# EAGLE design RGBdriverModuleAutoCurrentSingle (EAGLE 5.07)
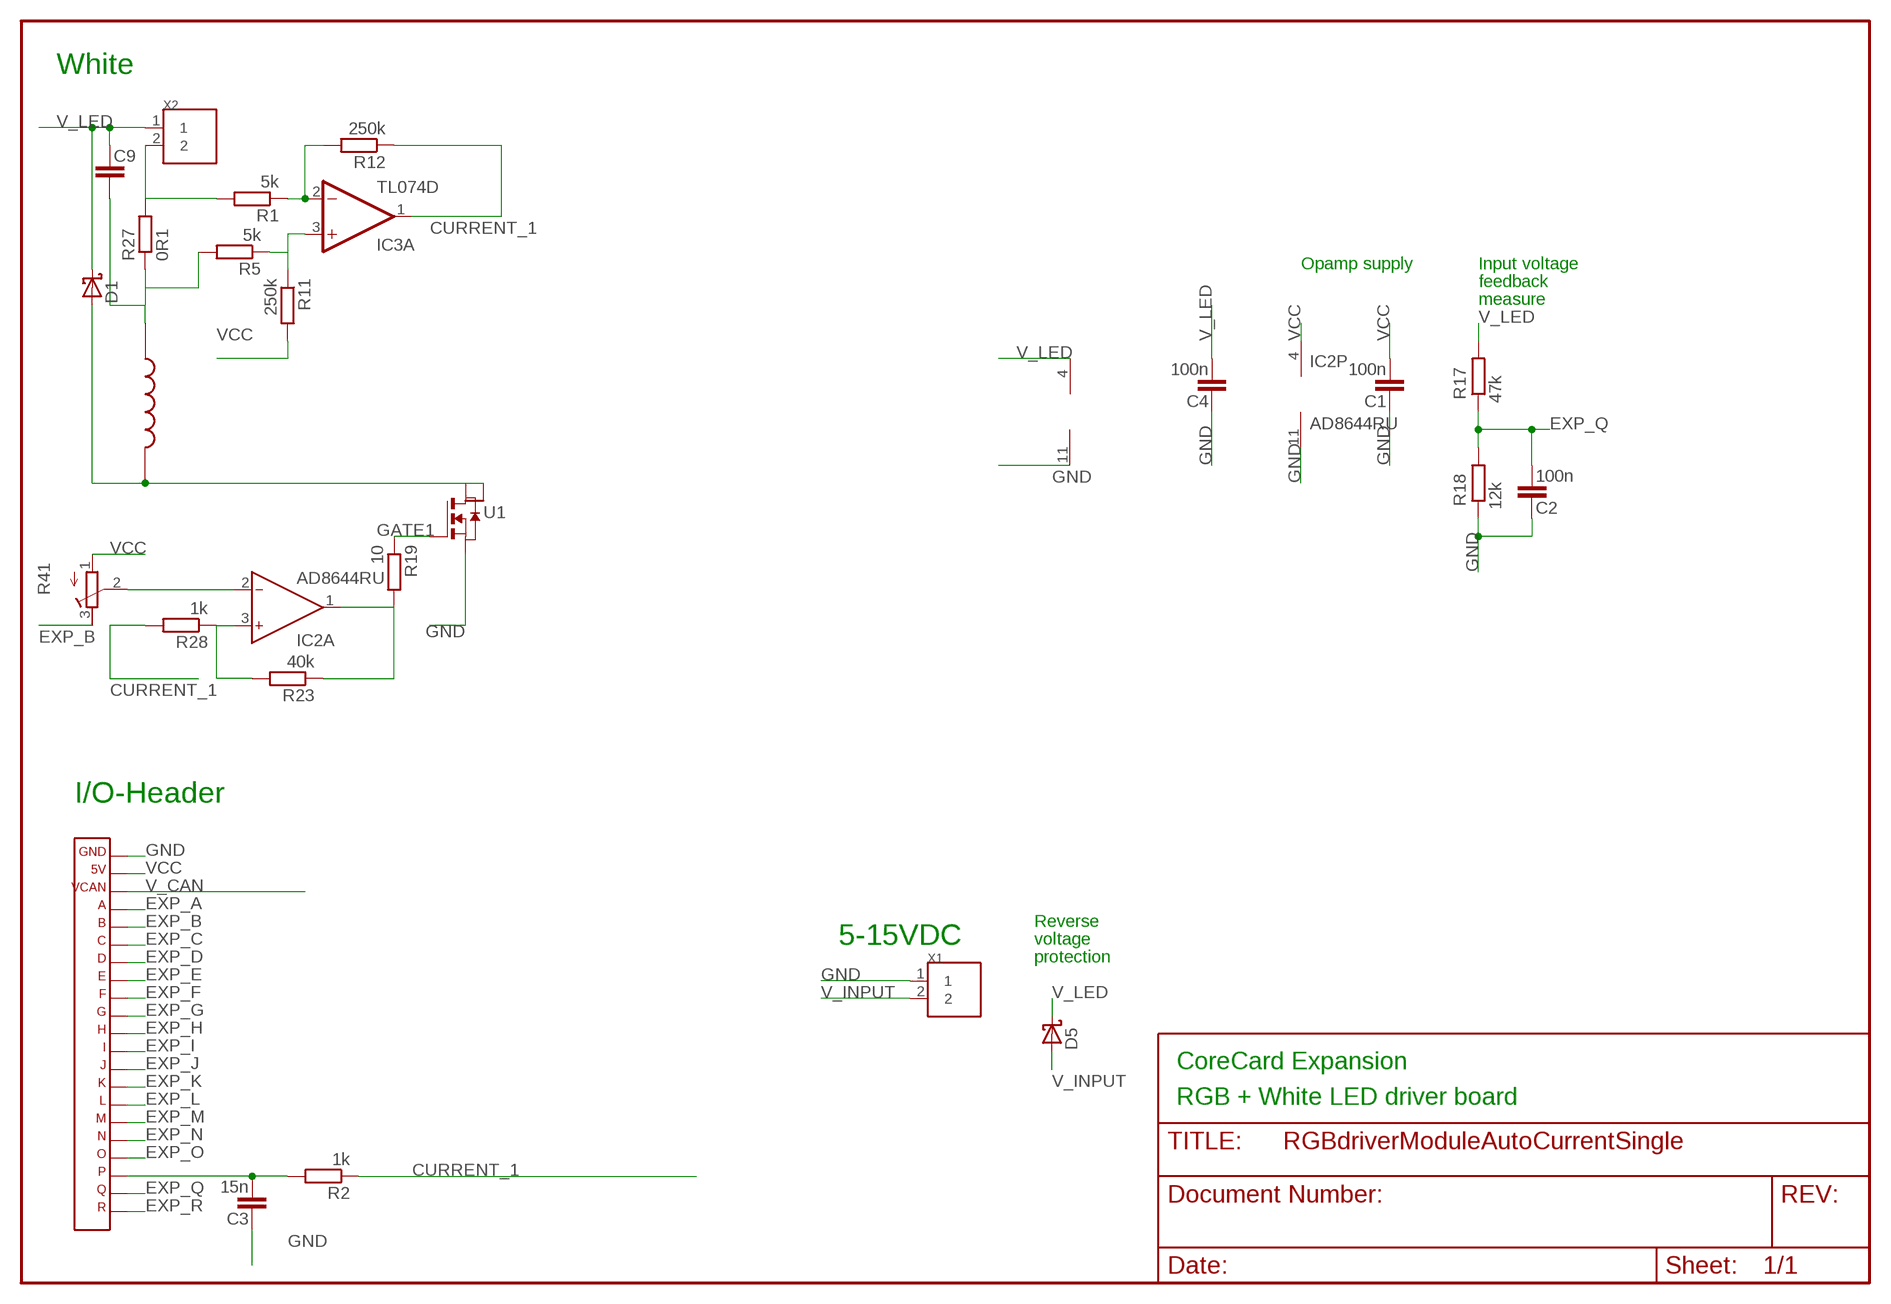
[diagram p0: schematic, sheet 1]

## Parts
C1  100n  C-EUC0603  [C0603]
C2  100n  C-EUC0603  [C0603]
C3  15n  C-EUC0603  [C0603]
C4  100n  C-EUC0603  [C0603]
C9  C-EUC1210  [C1210]
D1  SCHOTTKY-DIODESMC  [SMC]
D5  SCHOTTKY-DIODESMC  [SMC]
IC2  AD8644RU  [TSSOP14]
IC3  TL074D  [SO14]
L1  10X10  [10X10]
R1  5k  R-EUR0603  [R0603]
R2  1k  R-EUR0603  [R0603]
R5  5k  R-EUR0603  [R0603]
R11  250k  R-EUR0603  [R0603]
R12  250k  R-EUR0603  [R0603]
R17  47k  R-EUR0603  [R0603]
R18  12k  R-EUR0603  [R0603]
R19  10  R-EUR0603  [R0603]
R23  40k  R-EUR0603  [R0603]
R27  0R1  R-EUR1206  [R1206]
R28  1k  R-EUR0603  [R0603]
R41  R-TRIM  [TRIM_PVZ3]
U1  NFT3055L175  [SOT223]
X1  BLOCK2  [PCB2]
X2  BLOCK2  [PCB2]
X3  CORE_IOHEADEXP  [CORE_IOHEAD_NOSILC]

## Nets
CURRENT_1: IC3.1(A:OUT) R2.1 R12.1 R28.2
EXP_A: X3.4
EXP_B: R41.3(PAD3) X3.5
EXP_C: X3.6
EXP_D: X3.7
EXP_E: X3.8
EXP_F: X3.9
EXP_G: X3.10
EXP_H: X3.11
EXP_I: X3.12
EXP_J: X3.13
EXP_K: X3.14
EXP_L: X3.15
EXP_M: X3.16
EXP_N: X3.17
EXP_O: X3.18
EXP_Q: C2.2 R17.1 R18.2 X3.20
EXP_R: X3.21
GATE1: R19.1 U1.1(G)
GND: C1.1 C2.1 C3.1 C4.1 IC2.11(P:V-) IC3.11(P:V-) R18.1 U1.3(S) X1.1 X3.1
L1: D1.A L1.P$2 U1.2(D) U1.4(D_PAD)
N$1: IC2.3(A:IN+) R23.2 R28.1
N$4: C3.2 R2.2 X3.19
N$5: C9.2 L1.P$1 R5.2 R27.1
N$12: R1.2 R27.2 X2.2
N$16: IC2.1(A:OUT) R19.2 R23.1
N$19: IC3.3(A:+IN) R5.1 R11.1
N$21: IC3.2(A:-IN) R1.1 R12.2
N$30: IC2.2(A:IN-) R41.2(PAD2)
V_CAN: X3.3
V_INPUT: D5.A X1.2
V_LED: C4.2 C9.1 D1.C D5.C IC3.4(P:V+) R17.2 X2.1
VCC: C1.2 IC2.4(P:V+) R11.2 R41.1(PAD1) X3.2
Unconnected: IC2.5(B:IN+) IC2.6(B:IN-) IC2.7(B:OUT) IC2.8(C:OUT) IC2.9(C:IN-) IC2.10(C:IN+) IC2.12(D:IN+) IC2.13(D:IN-) IC2.14(D:OUT) IC3.5(B:+IN) IC3.6(B:-IN) IC3.7(B:OUT) IC3.8(C:OUT) IC3.9(C:-IN) IC3.10(C:+IN) IC3.12(D:+IN) IC3.13(D:-IN) IC3.14(D:OUT)

## Notes on the sheet
- White
- Opamp supply | Input voltage
- feedback
- measure
- I/O-Header
- Reverse
- 5-15VDC | voltage
- protection
- CoreCard Expansion
- RGB + White LED driver board

## Library data of the parts
C1-C4 C9 = rcl:C-EU
D1 D5 = diode:SCHOTTKY-DIODE
IC2 = analog-devices:AD8644: Single and Quad 18 V Operational Amplifiers Source: http://www.analog.com/static/imported-files/data_sheets/AD8614_8644.pdf
IC3 = linear:TL074: OP AMP
L1 = inductor10x10:10X10
R1 R2 R5 R11 R12 R17-R19 R23 R27 R28 = rcl:R-EU
R41 = rcl:R-TRIM
U1 = NMOS_NTF3055L175:NFT3055L175
X1 X2 = terminal_block:BLOCK2
X3 = expboard:CORE_IOHEAD: CoreCard IO-header for expansion cards

## Board
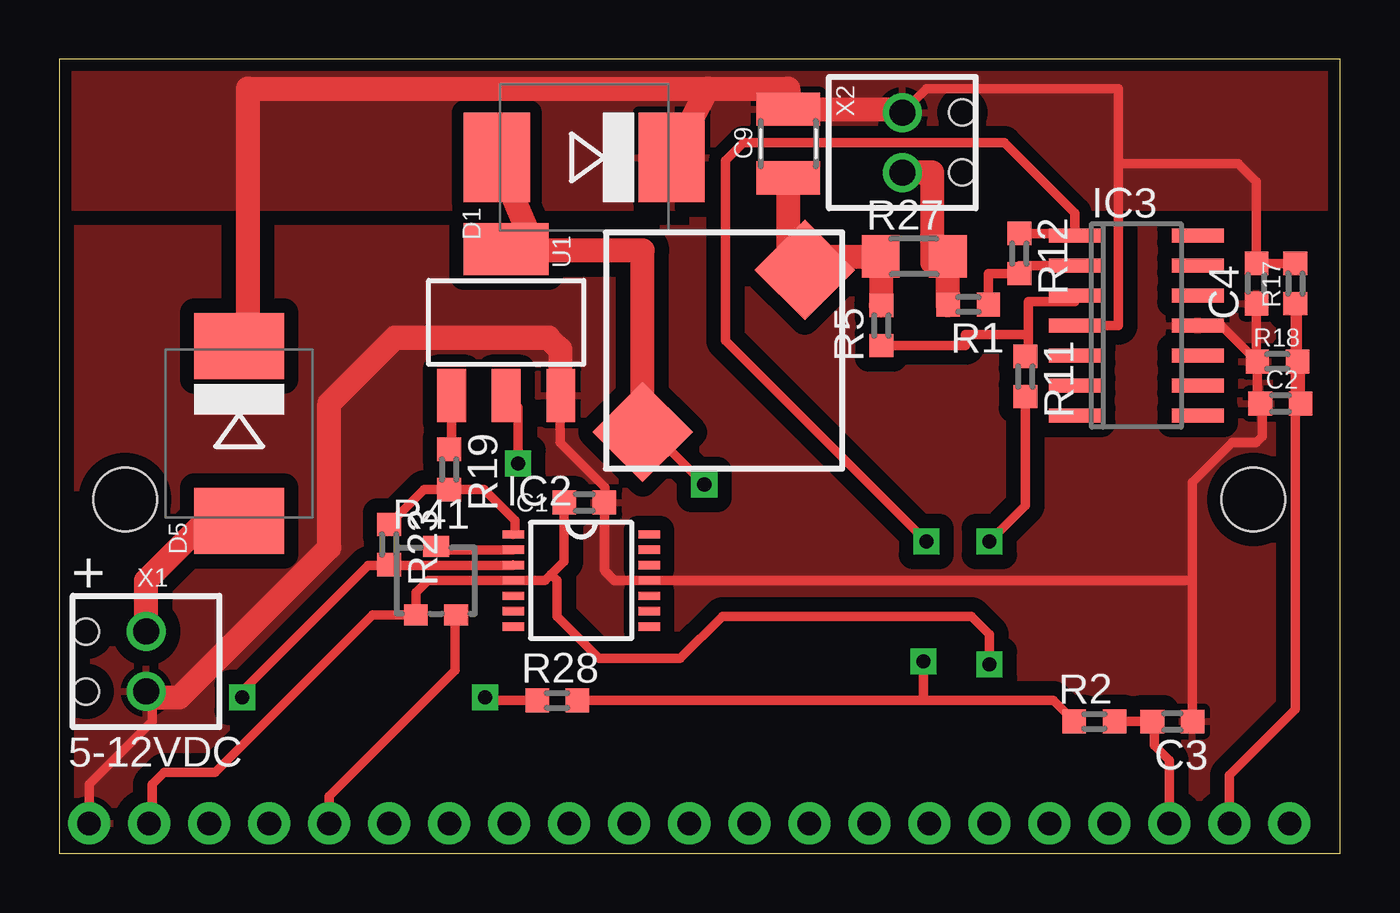
[diagram p1: board, top side]
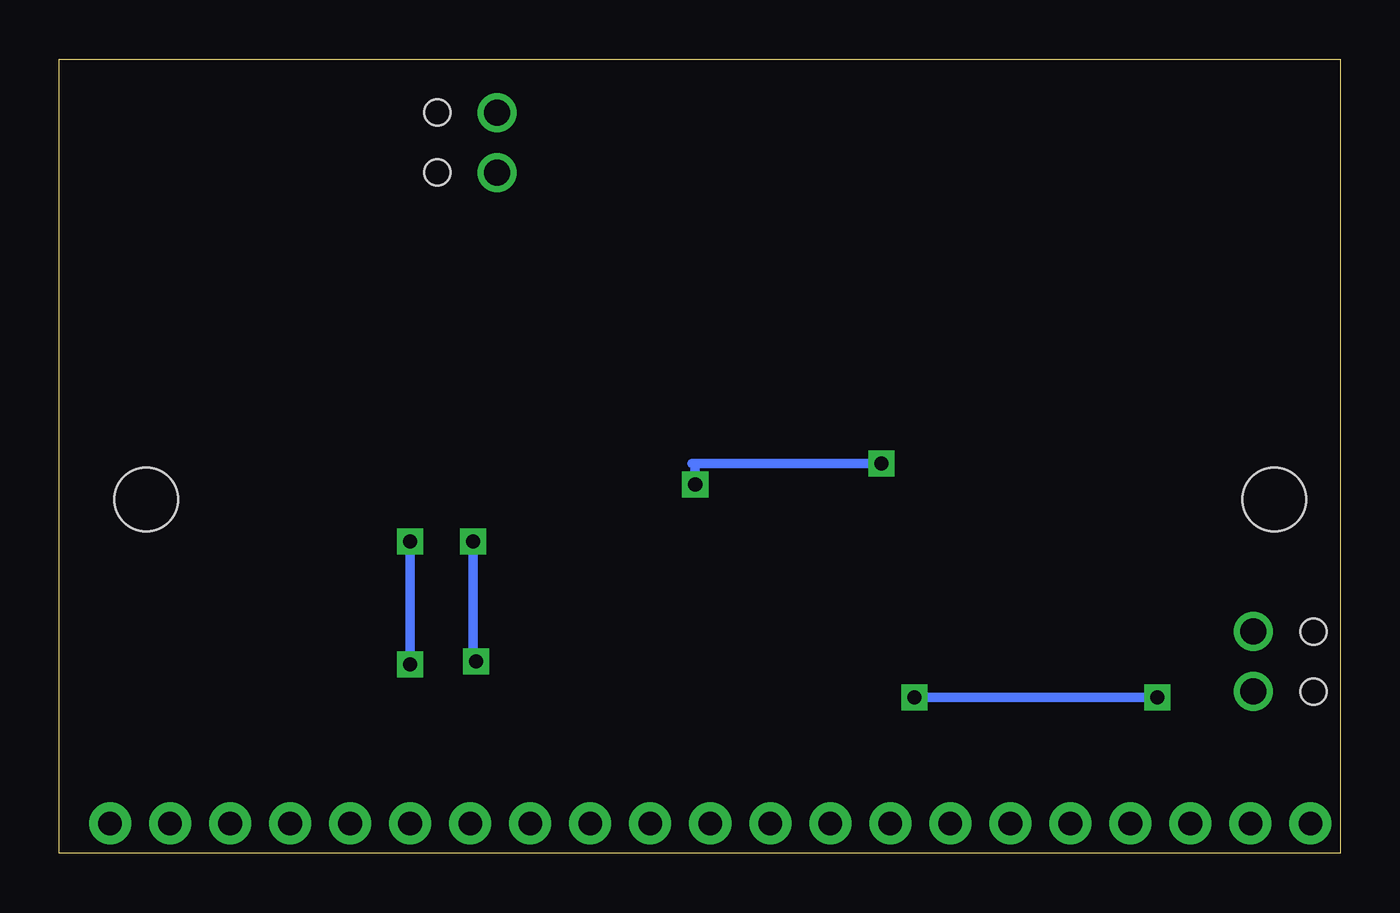
[diagram p2: board, bottom side, seen from below]

Size 54.23 x 33.63 mm. Coordinates in mm from the lower left corner, seen from the top.
Outline: 0,0 54.23,0 54.23,33.63 0,33.63 0,0
Copper layers (1*16): Top 0.035mm / dielectric 1.5mm / Bottom 0.035mm
Design rules "default": minimum track width 10mil, minimum drill 0.4mm, track to track 10mil, track to pad 10mil, pad to pad 10mil, via to via 10mil, smd to smd 8mil, copper to edge 10mil, drill to drill 8mil, minimum pad ring 10mil, minimum via ring 10mil, stop-mask expansion 4mil, vias tented up to drill 18mil, thermal gap 10mil
Holes 2.7 mm at 2.79,14.99 50.55,14.99

### Footprints (pad centres in the part's own frame; a part is rotated, then mirrored left to right if it is on the bottom)
C0603 = smd 1 x 1: 1 -0.85,0; 2 0.85,0
C1210 = smd 1.4 x 2.7: 1 -1.4,0; 2 1.5,0
SMC = smd 2.8 x 3.8: A 3.7,0; C -3.7,0
TSSOP14 = smd 0.9 x 0.35: 1 -2.875,1.95; 2 -2.875,1.3; 3 -2.875,0.65; 4 -2.875,0; 5 -2.875,-0.65; 6 -2.875,-1.3; 7 -2.875,-1.95; 8 2.875,-1.95; 9 2.875,-1.3; 10 2.875,-0.65; 11 2.875,0; 12 2.875,0.65; 13 2.875,1.3; 14 2.875,1.95
SO14 = smd 0.6 x 2.2: 1 -3.81,-2.6; 2 -2.54,-2.6; 3 -1.27,-2.6; 4 0,-2.6; 5 1.27,-2.6; 6 2.54,-2.6; 7 3.81,-2.6; 8 3.81,2.6; 9 2.54,2.6; 10 1.27,2.6; 11 0,2.6; 12 -1.27,2.6; 13 -2.54,2.6; 14 -3.81,2.6
10X10 = smd 3 x 3 rotated 45: P$1 1.588,1.588; P$2 8.447,8.447
R0603 = smd 0.991 x 1.016: 1 -0.85,0; 2 0.85,0
R1206 = smd 1.6 x 1.803: 1 -1.422,0; 2 1.422,0
TRIM_PVZ3 = smd 1 x 0.9: 1 0.5,0.45; 3 2.2,0.45 | smd 1.1 x 0.9: 2 1.35,3.35
SOT223 = smd 1.219 x 2.235: 1 -2.311,-3.099; 2 0,-3.099; 3 2.311,-3.099 | smd 3.6 x 2.2: 4 0,3.099
PCB2 = drill 1.1 round: 1 -2.54,0; 2 0,0 | hole 1.1: -2.54,2.54; 0,2.54
CORE_IOHEAD_NOSILC = drill 1 pad 1.778 round: 1 25.4,0; 2 22.86,0; 3 20.32,0; 4 17.78,0; 5 15.24,0; 6 12.7,0; 7 10.16,0; 8 7.62,0; 9 5.08,0; 10 2.54,0; 11 0,0; 12 -2.54,0; 13 -5.08,0; 14 -7.62,0; 15 -10.16,0; 16 -12.7,0; 17 -15.24,0; 18 -17.78,0; 19 -20.32,0; 20 -22.86,0; 21 -25.4,0

### Placement (x,y rotation side)
C1  22.23,14.86 180 top
C2  51.69,19.05 0 top
C3  47.12,5.59 180 top
C4  50.67,24.13 90 top
C9  30.86,30.1 270 top
D1  22.23,29.46 180 top
D5  7.62,17.78 270 top
IC2  22.1,11.56 0 top
IC3  45.59,22.35 270 top
L1  33.15,26.29 180 top
R1  38.48,23.24 180 top
R2  43.81,5.59 0 top
R5  34.8,22.35 90 top
R11  40.89,20.19 270 top
R12  40.64,25.4 270 top
R17  52.32,24.13 90 top
R18  51.56,20.83 0 top
R19  16.51,16.26 270 top
R23  13.97,13.08 270 top
R27  36.2,25.27 0 top
R28  21.08,6.48 0 top
R41  14.61,9.65 0 top
U1  18.92,22.48 0 top
X1  3.68,9.4 90 top
X2  35.69,28.83 270 top
X3  26.67,1.27 0 bottom

### Tracks (layer width: path | path; a pad name or v marks a point on that pad's centre or on a via)
CURRENT_1  (via drill 0.6)
  Top 0.406: R12.1 42.99,26.25 IC3.1 42.99,27.11 40.01,30.1 28.96,30.1 28.19,29.34 28.19,21.72 v36.7,13.21 | R28.2 36.7,6.48 | 36.7,6.48 42.08,6.48 R2.1 | v36.58,8.13 36.58,6.6 36.7,6.48
  Bottom 0.406: v36.7,13.21 36.7,8.26 v36.58,8.13
EXP_B
  Top 0.406: X3.5 11.43,2.41 16.76,7.75 16.76,10.06 R41.3
EXP_Q
  Top 0.406: X3.20 49.53,3.3 52.32,6.1 R17.1 52.41,23.19 R18.2 52.54,20.7 C2.2
GATE1
  Top 0.406: U1.1 16.61,17.21 R19.1
GND
  Top 0.406: IC3.11 49.19,22.35 R18.1 | R18.1 50.71,19.18 C2.1 50.93,18.96 50.93,17.65 50.67,17.4 49.66,17.4 47.97,15.71 47.97,11.68 | C4.1 50.67,20.87 R18.1 | 47.97,11.68 C3.1 | X3.1 1.27,2.92 3.94,5.59 3.94,6.6 X1.1 3.81,6.73 | 47.97,11.68 47.84,11.56 IC2.11 23.5,11.56 23.07,11.98 C1.1 23.11,14.9 23.11,15.49 21.21,17.4 21.21,18.8
  Top 1.016: 3.94,6.6 5.08,6.6 11.43,12.95 11.43,19.05 14.22,21.84 20.7,21.84 21.21,21.34 21.21,19.36 | 21.21,19.36 21.21,18.8 | 21.21,19.36 U1.3
  pour Top (isolate 0.61, rank 3): 0.25,27.53 53.85,27.15 53.85,0.76 0.51,0.76
L1  (via drill 0.6)
  Top 0.406: U1.2 19.43,18.87 v19.43,16.51 | v27.3,15.62 25.08,17.84 L1.P$2
  Top 1.016: D1.A 20.18,25.58 U1.4 19.18,25.58 19.18,25.53 24.7,25.53 L1.P$2
  Bottom 0.406: v19.43,16.51 27.43,16.51 27.3,16.38 v27.3,15.62
N$1  (via drill 0.6)
  Top 0.406: IC2.3 19.21,12.19 14.1,12.19 14.06,12.23 R23.2 13.93,12.19 13.08,12.19 7.75,6.86 v7.75,6.6 | R28.1 18.16,6.48 v18.03,6.6
  Bottom 0.406: v7.75,6.6 v18.03,6.6
N$4
  Top 0.406: X3.19 46.99,3.94 46.35,4.57 46.35,5.5 C3.2 R2.2
N$5
  Top 1.016: C9.2 30.86,24.7 L1.P$1 31.56,25.27 R27.1 34.77,23.2 R5.2
N$12
  Top 1.016: X2.2 36.96,28.83 36.96,25.02 37.62,25.02 R27.2 37.62,23.2 R1.2
N$16
  Top 0.406: R23.1 15.45,15.41 R19.2 18,15.41 19.3,14.1 19.3,13.59 IC2.1
N$19
  Top 0.406: R5.1 38.35,21.5 38.35,21.97 41.02,21.97 | 41.02,21.97 41.02,23.37 42.99,23.37 IC3.3 | R11.1 41.02,21.04 41.02,21.97
N$21
  Top 0.406: IC3.2 40.64,24.89 R12.2 39.33,24.55 R1.1
N$30
  Top 0.406: IC2.2 16.1,12.86 R41.2
V_INPUT
  Top 0.406: 6.21,14.08 D5.A
  Top 1.016: 6.21,14.08 3.68,11.56 X1.2
V_LED
  Top 0.406: R17.2 C4.2 50.67,28.45 49.91,29.21 44.96,29.21 44.83,29.34 | IC3.4 44.83,22.35 44.83,29.34 | 44.83,29.34 44.83,32.38 36.7,32.38 X2.1
  Top 1.016: D5.C 8,21.48 8,32.38 27.45,32.38 | 27.45,32.38 D1.C | 27.45,32.38 30.86,32.38 C9.1 35.69,31.5 X2.1
  pour Top (isolate 0.508): 0.38,33.5 53.98,33.38 53.85,27.33 0.51,27.33
VCC  (via drill 0.6)
  Top 0.406: C1.2 21.38,12.36 20.83,11.81 | 20.83,11.81 20.57,11.56 IC2.4 15.62,11.56 15.11,11.05 R41.1 13.28,10.1 6.6,3.43 4.45,3.43 3.94,2.92 3.94,1.4 X3.2 | R11.2 40.89,14.73 v39.37,13.21 | v39.37,8 39.37,9.27 38.61,10.03 28.07,10.03 26.29,8.26 22.86,8.26 21.08,10.03 21.08,11.56 20.83,11.81
  Bottom 0.406: v39.37,8 v39.37,13.21

### Text on the board
tPlace: + | 5-12VDC
Document: Corecard edge | Top is component side | Expansion will be mounted bottom to bottom with CoreCard | Change vertical dimension to fit | Remove I/O-header silcscreen if neccesary | Remove mounting holes if neccesary
tDocu: A | B | C | D | E | F | G | H | I | J | K | L | M | N | O | P | Q | R